# Altium schematic sheet MCU.SchDoc
size A
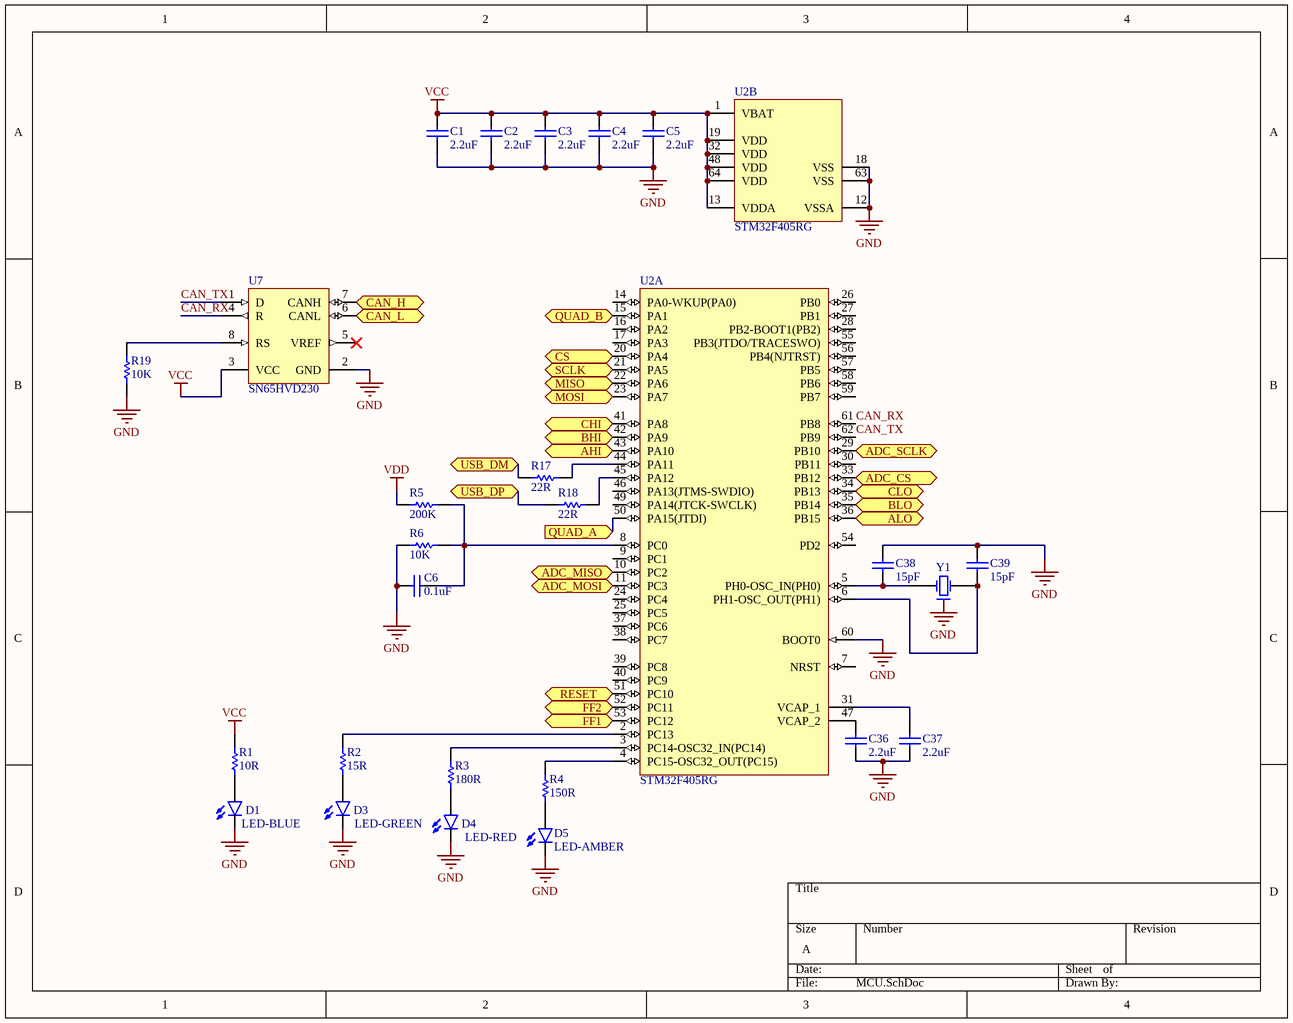
[diagram p0: MCU.SchDoc]

## Parts
C1  2.2uF  [CAPC0603(1608)55_N]
C2  2.2uF  [CAPC0603(1608)55_N]
C3  2.2uF  [CAPC0603(1608)55_N]
C4  2.2uF  [CAPC0603(1608)55_N]
C5  2.2uF  [CAPC0603(1608)55_N]
C6  0.1uF  [CAPC0603(1608)100_L]
C36  2.2uF  [CAPC0603(1608)55_N]
C37  2.2uF  [CAPC0603(1608)55_N]
C38  15pF  [CAPC0603(1608)100_M]
C39  15pF  [CAPC0603(1608)100_M]
D1  LED-BLUE  [LED-1206]
D3  LED-GREEN  [LED-1206]
D4  LED-RED  [LED-1206]
D5  LED-AMBER  [LED-1206]
R1  10R  [RESC0603(1608)_N]
R2  15R  [RESC0603(1608)_N]
R3  180R  [RESC0603(1608)_N]
R4  150R  [RESC0603(1608)_N]
R5  200K  [RESC0603(1608)_N]
R6  10K  [RESC0603(1608)_N]
R17  22R  [RESC0603(1608)_N]
R18  22R  [RESC0603(1608)_N]
R19  10K  [RESC0603(1608)_N]
U2  STM32F405RG  (parts A,B of 2)
U7  SN65HVD230  [D8_M]
Y1  (no value)  [ABRA-ABM3B-4_V]

## Ports
ADC_CS (out), ADC_MISO (in), ADC_MOSI (out), ADC_SCLK (out), AHI (out), ALO (out), BHI (out), BLO (out), CAN_H (in), CAN_L (in), CHI (out), CLO (out), CS (out), FF1 (in), FF2 (in), MISO (in), MOSI (out), QUAD_A (in), QUAD_B (in), RESET (out), SCLK (out), USB_DM, USB_DP

## Nets
GND: C1.1 C2.1 C3.1 C4.1 C5.1 C6.1 C36.1 C37.1 C38.2 C39.2 D1.C D3.C D4.C D5.C R6.1 R19.1 U2.12(VSSA) U2.18(VSS) U2.60(BOOT0) U2.63(VSS) U7.2(GND) Y1.2
VCC: C1.2 C2.2 C3.2 C4.2 C5.2 R1.2 U2.1(VBAT) U2.13(VDDA) U2.19(VDD) U2.32(VDD) U2.48(VDD) U2.64(VDD) U7.3(VCC)
VDD: R5.1
ADC_CS: U2.33(PB12) ; port ADC_CS
ADC_MISO: U2.10(PC2) ; port ADC_MISO
ADC_MOSI: U2.11(PC3) ; port ADC_MOSI
ADC_SCLK: U2.29(PB10) ; port ADC_SCLK
AHI: U2.43(PA10) ; port AHI
ALO: U2.36(PB15) ; port ALO
BHI: U2.42(PA9) ; port BHI
BLO: U2.35(PB14) ; port BLO
CAN_H: U7.7(CANH) ; port CAN_H
CAN_L: U7.6(CANL) ; port CAN_L
CAN_RX: U2.61(PB8) U7.4(R)
CAN_TX: U2.62(PB9) U7.1(D)
CHI: U2.41(PA8) ; port CHI
CLO: U2.34(PB13) ; port CLO
CS: U2.20(PA4) ; port CS
FF1: U2.53(PC12) ; port FF1
FF2: U2.52(PC11) ; port FF2
MISO: U2.22(PA6) ; port MISO
MOSI: U2.23(PA7) ; port MOSI
QUAD_A: U2.50(PA15(JTDI)) ; port QUAD_A
QUAD_B: U2.15(PA1) ; port QUAD_B
RESET: U2.51(PC10) ; port RESET
SCLK: U2.21(PA5) ; port SCLK
USB_DM: R17.1 ; port USB_DM
USB_DP: R18.1 ; port USB_DP
NetC6_2: C6.2 R5.2 R6.2 U2.8(PC0)
NetC36_2: C36.2 U2.47(VCAP_2)
NetC37_2: C37.2 U2.31(VCAP_1)
NetC38_1: C38.1 U2.5(PH0-OSC_IN(PH0)) Y1.1(X1)
NetC39_1: C39.1 U2.6(PH1-OSC_OUT(PH1)) Y1.3(X2)
NetD1_A: D1.A R1.1
NetD3_A: D3.A R2.1
NetD4_A: D4.A R3.1
NetD5_A: D5.A R4.1
NetR2_2: R2.2 U2.2(PC13)
NetR3_2: R3.2 U2.3(PC14-OSC32_IN(PC14))
NetR4_2: R4.2 U2.4(PC15-OSC32_OUT(PC15))
NetR17_2: R17.2 U2.44(PA11)
NetR18_2: R18.2 U2.45(PA12)
NetR19_2: R19.2 U7.8(RS)

Not connected (* = marked no-connect by the designer): U2 7(NRST) 9(PC1) 14(PA0-WKUP(PA0)) 16(PA2) 17(PA3) 24(PC4) 25(PC5) 26(PB0) 27(PB1) 28(PB2-BOOT1(PB2)) 30(PB11) 37(PC6) 38(PC7) 39(PC8) 40(PC9) 46(PA13(JTMS-SWDIO)) 49(PA14(JTCK-SWCLK)) 54(PD2) 55(PB3(JTDO/TRACESWO)) 56(PB4(NJTRST)) 57(PB5) 58(PB6) 59(PB7); U7 5(VREF)*

## Library data of the parts
C1-C5 C36 C37 = CMP-1035-02762-1: CAP 2.2uF 16V Â±10% 0603 (1608 Metric) Thickness 0.55mm SMD; Case-EIA: 0603; Case-Metric: 1608; Max Thickness: 0.55 mm; Technology: SMT; Value: 2.2uF; Rated Voltage: 16 V; Tolerance: Â±10%
C6 = CMP-1035-02591-1: CAP 100nF 50V Â±5% 0603 (1608 Metric) Thickness 1mm SMD; Case-Metric: 1608; Case-EIA: 0603; Rated Voltage: 50 V; Max Thickness: 1 mm; Tolerance: Â±5%; Technology: SMT; Value: 100nF
C38 C39 = CMP-1035-00686-1: CAP 15pF 100V Â±0.25pF 0603 (1608 Metric) Thickness 1mm SMD; Case-Metric: 1608; Case-EIA: 0603; Rated Voltage: 100 V; Max Thickness: 1 mm; Value: 15pF; Tolerance: Â±0.25pF; Technology: SMT
D1 = LED-BLUE1206: PROD_ID: DIO-09911
D3 = LED-GREEN1206: PROD_ID: DIO-00862
D4 = LED-RED1206: PROD_ID: DIO-09912
D5 = LED-AMBER1206
R1 = CMP-1012-00026-1: 10R 0.1W 5% 0603 (1608 Metric)  SMD; Case-Metric: 1608; Case-EIA: 0603; Value: 10.00 Ohm; Technology: SMT; Tolerance: 5 %; Power: 0.1 W
R2 = CMP-1012-00030-1: 15R 0.1W 5% 0603 (1608 Metric)  SMD; Case-EIA: 0603; Case-Metric: 1608; Value: 15.00 Ohm; Tolerance: 5 %; Technology: SMT; Power: 0.1 W
R3 = CMP-1012-00056-1: 180R 0.1W 5% 0603 (1608 Metric)  SMD; Value: 180.00 Ohm; Case-EIA: 0603; Case-Metric: 1608; Power: 0.1 W; Technology: SMT; Tolerance: 5 %
R4 = CMP-1012-00054-1: 150R 0.1W 5% 0603 (1608 Metric)  SMD; Case-EIA: 0603; Value: 150.00 Ohm; Case-Metric: 1608; Power: 0.1 W; Tolerance: 5 %; Technology: SMT
R5 = CMP-1012-00129-1: 200K 0.1W 5% 0603 (1608 Metric)  SMD; Case-EIA: 0603; Value: 200000.00 Ohm; Case-Metric: 1608; Technology: SMT; Power: 0.1 W; Tolerance: 5 %
R6 R19 = CMP-1012-00098-1: 10K 0.1W 5% 0603 (1608 Metric)  SMD; Case-EIA: 0603; Value: 10000.00 Ohm; Case-Metric: 1608; Technology: SMT; Tolerance: 5 %; Power: 0.1 W
R17 R18 = CMP-1012-00034-1: 22R 0.1W 5% 0603 (1608 Metric)  SMD; Value: 22.00 Ohm; Case-EIA: 0603; Case-Metric: 1608; Technology: SMT; Power: 0.1 W; Tolerance: 5 %
U2 = MC-ARM-STM32F4X5-SQ64
U7 = CMP-0315-00015-1: 3.3V CAN Transceiver with Standby Mode, 17 mA, -40 to 85 degC, 8-pin SOIC (D), Green (RoHS & no Sb/Br); Manufacturer: Texas Instruments; PartNumber: SN65HVD230DR; ICC(Max)(mA): 17; Supply Voltage(s)(V): 3.3; Drivers Per Package: 1; Transient Pulse Protection(V): -25 to 25; Rating: Catalog; Code_JEDEC: MS-012AA; Low Power Mode: Standby; PackageDescription: 8-Pin Plastic Small Outline Integrated Circuit, 4.9 x 3.9 mm, Pitch 1.27 mm Pitch; PackageReference: D8; DatasheetVersion: SLOS346K; Isolated: No; Receivers Per Package: 1; PackageVersion: revM, Jun-2011; Eco-Plan: Green (RoHS & no Sb/Br); SubFamily: CAN; ComponentLink1Description: Datasheet; Footprint: PCA82C250; Mounting Technology: Surface Mount; ComponentLink1URL: http://www.ti.com/general/docs/lit/getliterature.tsp?genericPartNumber=SN65HVD230&fileType=pdf
Y1 = ABRA-ABM3B-4